# Altium schematic sheet PowerAndController.SchDoc
size A
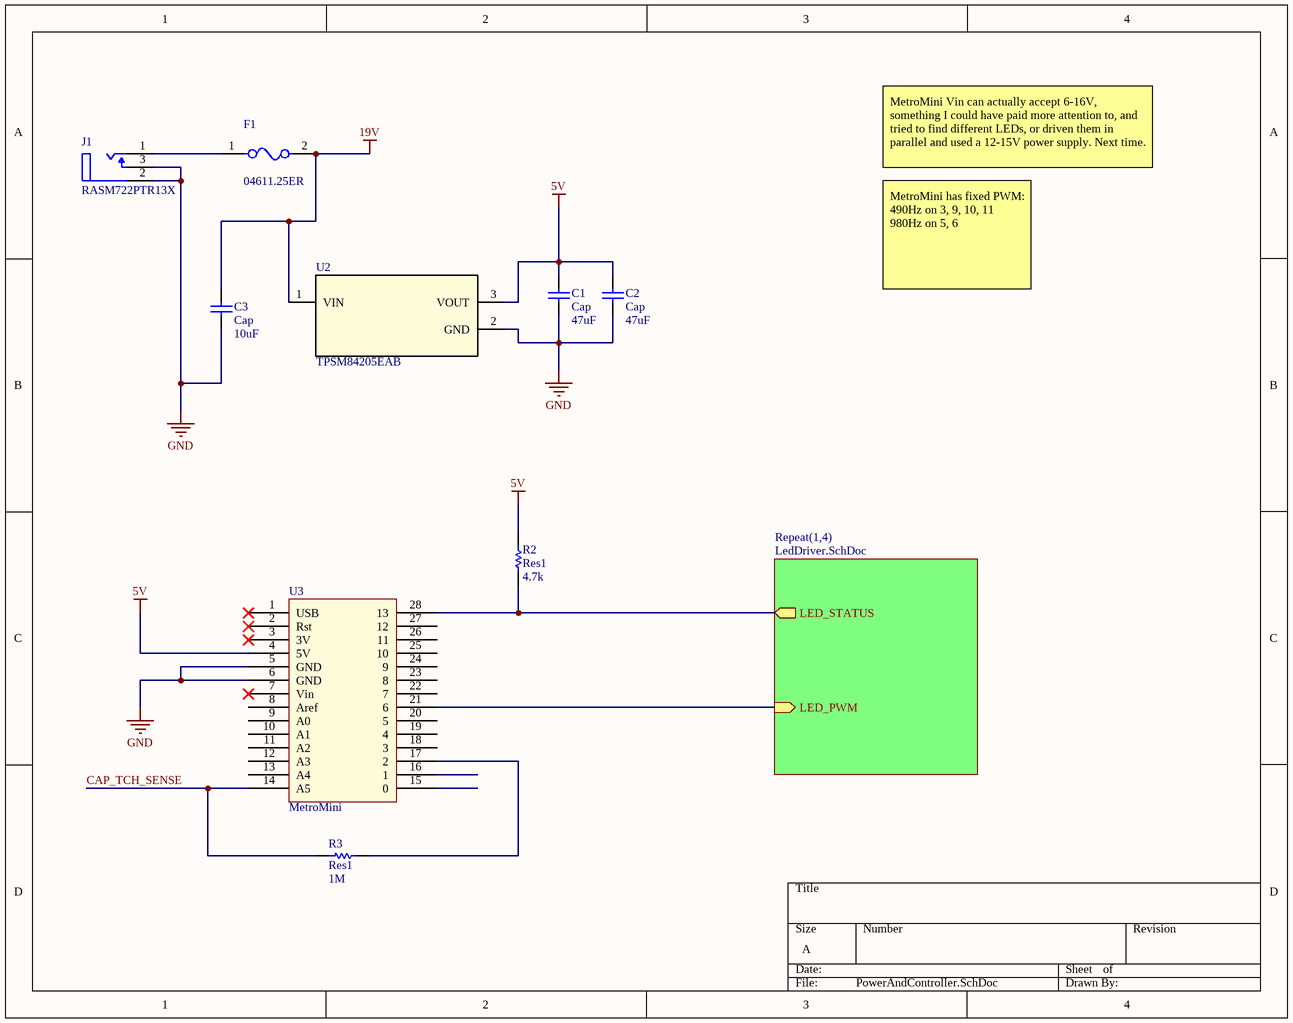
[diagram p0: PowerAndController.SchDoc]

## Parts
C1  Cap  value 47uF  [RAD-0.3]
C2  Cap  value 47uF  [RAD-0.3]
C3  Cap  value 10uF  [RAD-0.3]
F1  04611.25ER  [FP-0461-MFG]
J1  RASM722PTR13X  [FP-RASM722PTR13X-MFG]
R2  Res1  value 4.7k  [AXIAL-0.3]
R3  Res1  value 1M  [AXIAL-0.3]
U2  TPSM84205EAB  [EAB0003A]
U3  MetroMini

## Sub-sheets
Repeat(1,4) = LedDriver.SchDoc: LED_STATUS (out), LED_PWM (in)

## Nets
5V: C1.2 C2.2 R2.2 U2.3(VOUT) U3.4(5V)
19V: C3.2 F1.2 U2.1(VIN)
GND: C1.1 C2.1 C3.1 J1.2(SLEEVE_TERMINAL) J1.3(SHUNT_TERMINAL) U2.2(GND) U3.5(GND) U3.6(GND)
CAP_TCH_SENSE: R3.1 U3.14(A5)
NetF1_1: F1.1 J1.1(TIP_TERMINAL(CENTER_PIN))
NetR2_1: R2.1 U3.28(13) ; sheet Repeat(1,4)/LED_STATUS
NetR3_2: R3.2 U3.17(2)
NetU3_21: U3.21(6) ; sheet Repeat(1,4)/LED_PWM

Not connected (* = marked no-connect by the designer): U3 1(USB)* 2(Rst)* 3(3V)* 7(Vin)* 8(Aref) 9(A0) 10(A1) 11(A2) 12(A3) 13(A4) 15(0) 16(1) 18(3) 19(4) 20(5) 22(7) 23(8) 24(9) 25(10) 26(11) 27(12)

## Notes on the sheet
- MetroMini Vin can actually accept 6-16V, something I could have paid more attention to, and tried to find different LEDs, or driven them in parallel and used a 12-15V power supply. Next time.
- MetroMini has fixed PWM:
  490Hz on 3, 9, 10, 11
  980Hz on 5, 6

## Library data of the parts
C1-C3 = Cap: Capacitor; Published: 8-Jun-2000; LatestRevisionDate: 17-Jul-2002; LatestRevisionNote: Re-released for DXP Platform.; PackageReference: RAD-0.3; Publisher: Altium Limited; PackageDescription: Radial Cap, Thru-Hole; 2 Leads; 0.3 in Pin Spacing
F1 = CMP-08605-000011-1: FUSE BRD MNT 1.25A 600VAC/80VDC; Manufacturer: Littelfuse Inc; Resistance: 0.104Ω; Fuse Interrupt Ac Current: 60A; Max Fuse Dc Voltage: 80V; Fuse I2T: 16.5A2Sec; Value: 0.104Ω; Voltage Rating: 600V; Fuse Interrupt Dc Current: 100A; Fuse Blow Speed: Slow; Manufacturer Part Number: 04611.25ER; Temperature: -55°C to +125°C; Automotive: No; Temperature Range High: +125°C; Height: 3.12mm; Category: Fuse; Temperature Range Low: -55°C; ComponentLink2Description: Datasheet; Mouser Description: Surface Mount Fuses 600V 1.25A Telecom Fuse; Device Class L3: unset; ComponentLink2URL: https://www.littelfuse.com/~/media/electronics/datasheets/fuses/littelfuse_fuse_461_datasheet.pdf.pdf; Device Class L1: Circuit Protection; Digikey Description: FUSE BRD MNT 1.25A 600VAC/80VDC; Package: 0461; Max Fuse Ac Voltage: 600V; Device Class L2: Fuses; Lead Free: Yes; Ipc Land Pattern Name: CAPC1010312X312; Octopart: https://octopart.com/04611.25er-littelfuse-566039; RoHS: TRUE; Fuse Current: 1.25A
J1 = CMP-47995-000002-1: CONN PWR JACK 2.1X5.5MM SOLDER; Shielding: Unshielded; Gender: Male; Current Rating: 5A; Termination: Solder; Contact Material: Copper Alloy; Package Quantity: 120; Case/Package: SMD/SMT; Contact Plating: Tin; Connector Type: Jack; Housing Material: Thermoplastic; Mount: Surface Mount; Housing Color: Black; Color: Black
R2 R3 = Res1: Resistor; Published: 8-Jun-2000; LatestRevisionDate: 17-Jul-2002; LatestRevisionNote: Re-released for DXP Platform.; PackageReference: AXIAL-0.3; Publisher: Altium Limited; PackageDescription: Axial Device, Thru-Hole; 2 Leads; 0.3 in Pin Spacing
U2 = TPSM84205EAB: No Description Available; PartNumber: TPSM84205EABT; Manufacturer: Texas Instruments; RefDes: RefDes; Type: DEV; Value: Value; Copyright: Copyright (C) 2018 Accelerated Designs. All rights reserved